# EAGLE design Grove - 2-Coil Latching Relay v1 (EAGLE 6.3)
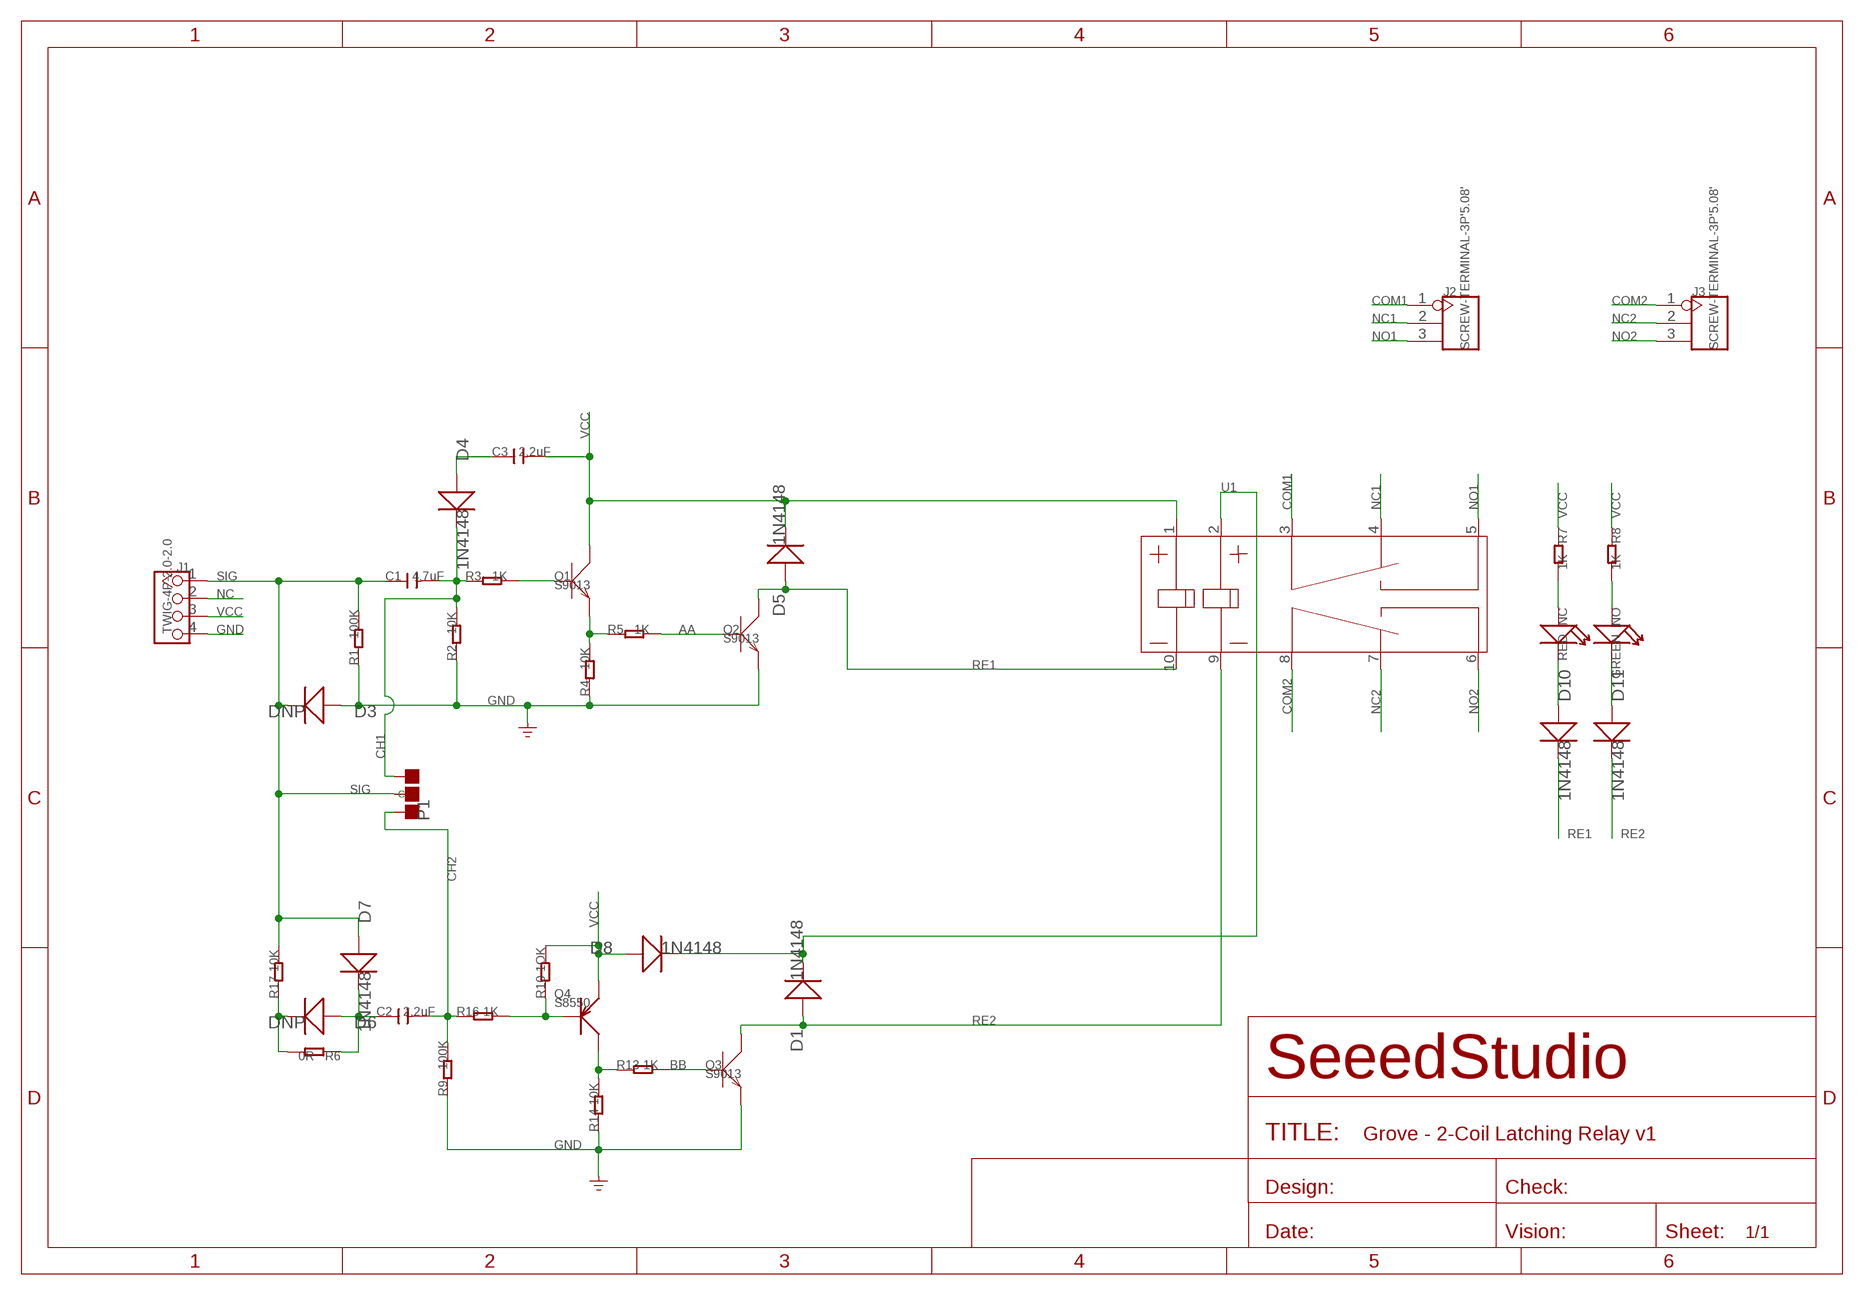
[diagram p0: schematic, sheet 1]

## Parts
C1  4.7uF  C-0805  [C0805]
C2  2.2uF  C-0805  [C0805]
C3  2.2uF  C-0805  [C0805]
D1  1N4148  D'1N4148-SMD'  [DO-35-SMD]
D3  DNP  D'1N4148-SMD'  [DO-35-SMD]
D4  1N4148  D'1N4148-SMD'  [DO-35-SMD]
D5  1N4148  D'1N4148-SMD'  [DO-35-SMD]
D6  DNP  D'1N4148-SMD'  [DO-35-SMD]
D7  1N4148  D'1N4148-SMD'  [DO-35-SMD]
D8  1N4148  D'1N4148-SMD'  [DO-35-SMD]
D10  1N4148  D'1N4148-SMD'  [DO-35-SMD]
D11  1N4148  D'1N4148-SMD'  [DO-35-SMD]
J1  TWIG-4P-2.0-2.0  [4P-2.0]
J2  SCREW-TERMINAL-3P'5.08'  [3P-5.08]
J3  SCREW-TERMINAL-3P'5.08'  [3P-5.08]
NC  RED  LED'0603'  [LED-0603]
NO  GREEN  LED'0603'  [LED-0603]
P1  PAD-JUMPER-3P-40*40  [3P-SMD-4.1X1.5]
Q1  S9013  TRANSISTOR-NPN-SOT23  [SOT23]
Q2  S9013  TRANSISTOR-NPN-SOT23  [SOT23]
Q3  S9013  TRANSISTOR-NPN-SOT23  [SOT23]
Q4  S8550  TRANSISTOR-PNP-SOT23  [SOT23]
R1  100K  R-0603  [R0603]
R2  10K  R-0603  [R0603]
R3  1K  R-0603  [R0603]
R4  10K  R-0603  [R0603]
R5  1K  R-0603  [R0603]
R6  0R  R-0603  [R0603]
R7  1K  R-0603  [R0603]
R8  1K  R-0603  [R0603]
R9  100K  R-0603  [R0603]
R10  1OK  R-0603  [R0603]
R13  1K  R-0603  [R0603]
R14  10K  R-0603  [R0603]
R16  1K  R-0603  [R0603]
R17  10K  R-0603  [R0603]
U1  RELAY-HFD2/005-S-L2'HFD2/005-S-L2'  [10P-20.2X10.2X10.6]

## Nets
AA: Q2.1(B) R5.2
BB: Q3.1(B) R13.2
CH1: C1.2 D4.C(-) P1.00(L) R2.2 R3.1
CH2: C2.2 P1.11(R) R9.2 R16.1
COM1: J2.1 U1.3
COM2: J3.1 U1.8
GND: D3.A(+) J1.4 Q2.2(E) Q3.2(E) R1.1 R2.1 R4.1 R9.1 R14.1
N$1: NO.+ R8.2
N$3: C3.1 D4.A(+)
N$4: Q1.1(B) R3.2
N$5: Q1.2(E) R4.2 R5.1
N$6: D10.A(+) NC.-
N$7: D11.A(+) NO.-
N$9: NC.+ R7.2
N$11: D6.C(-) R6.2 R17.1
N$12: C2.1 D6.A(+) D7.C(-) R6.1
N$15: Q4.1(B) R10.1 R16.2
N$17: D1.C(-) D8.C(-) U1.2
N$21: Q4.3(C) R13.1 R14.2
NC: J1.2
NC1: J2.2 U1.4
NC2: J3.2 U1.7
NO1: J2.3 U1.5
NO2: J3.3 U1.6
RE1: D5.A(+) D10.C(-) Q2.3(C) U1.10
RE2: D1.A(+) D11.C(-) Q3.3(C) U1.9
SIG: C1.1 D3.C(-) D7.A(+) J1.1 P1.MM(C) R1.2 R17.2
VCC: C3.2 D5.C(-) D8.A(+) J1.3 Q1.3(C) Q4.2(E) R7.1 R8.1 R10.2 U1.1

## Library data of the parts
C1-C3 = Discrete:C*: Ceramic Capacitors
D1 D3-D8 D10 D11 = Discrete:D*
J1 = Connector:TWIG-4P-2.0
J2 J3 = Connector:SCREW-TERMINAL-3P
NC NO = Discrete:LED*
P1 = Discrete:PAD-JUMPER-3P; PARTNO: DNP
Q1-Q3 = Discrete:TRANSISTOR-NPN*: NPN audion
Q4 = Discrete:TRANSISTOR-PNP*: PNP audion
R1-R10 R13 R14 R16 R17 = Discrete:R*
U1 = template:RELAY-HFD2/005-S-L2: 2 coils latching

## Board
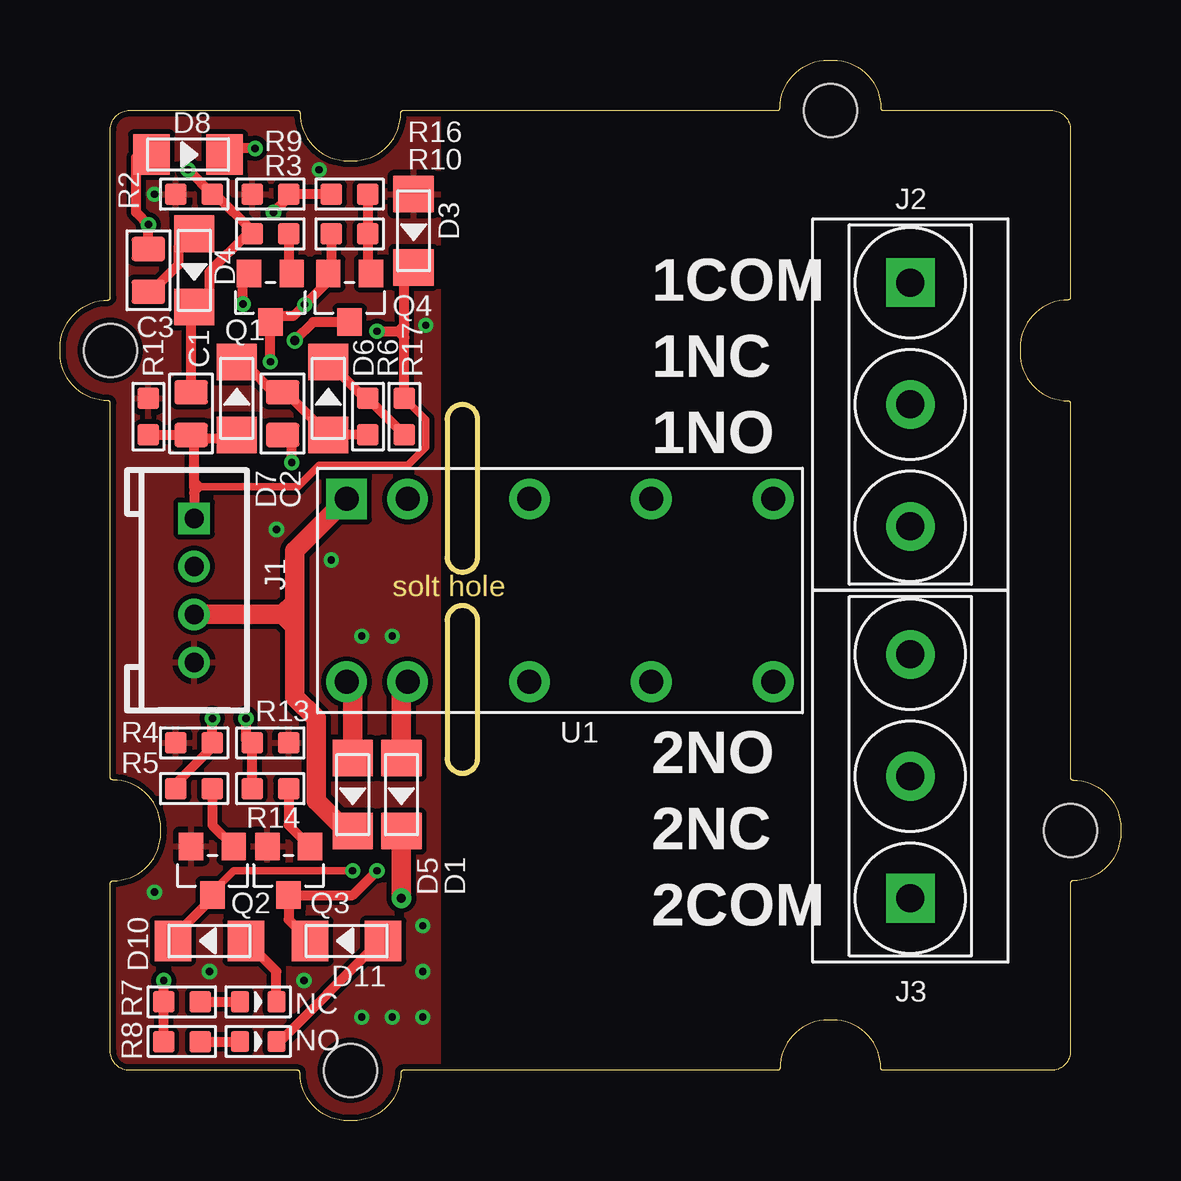
[diagram p1: board, top side]
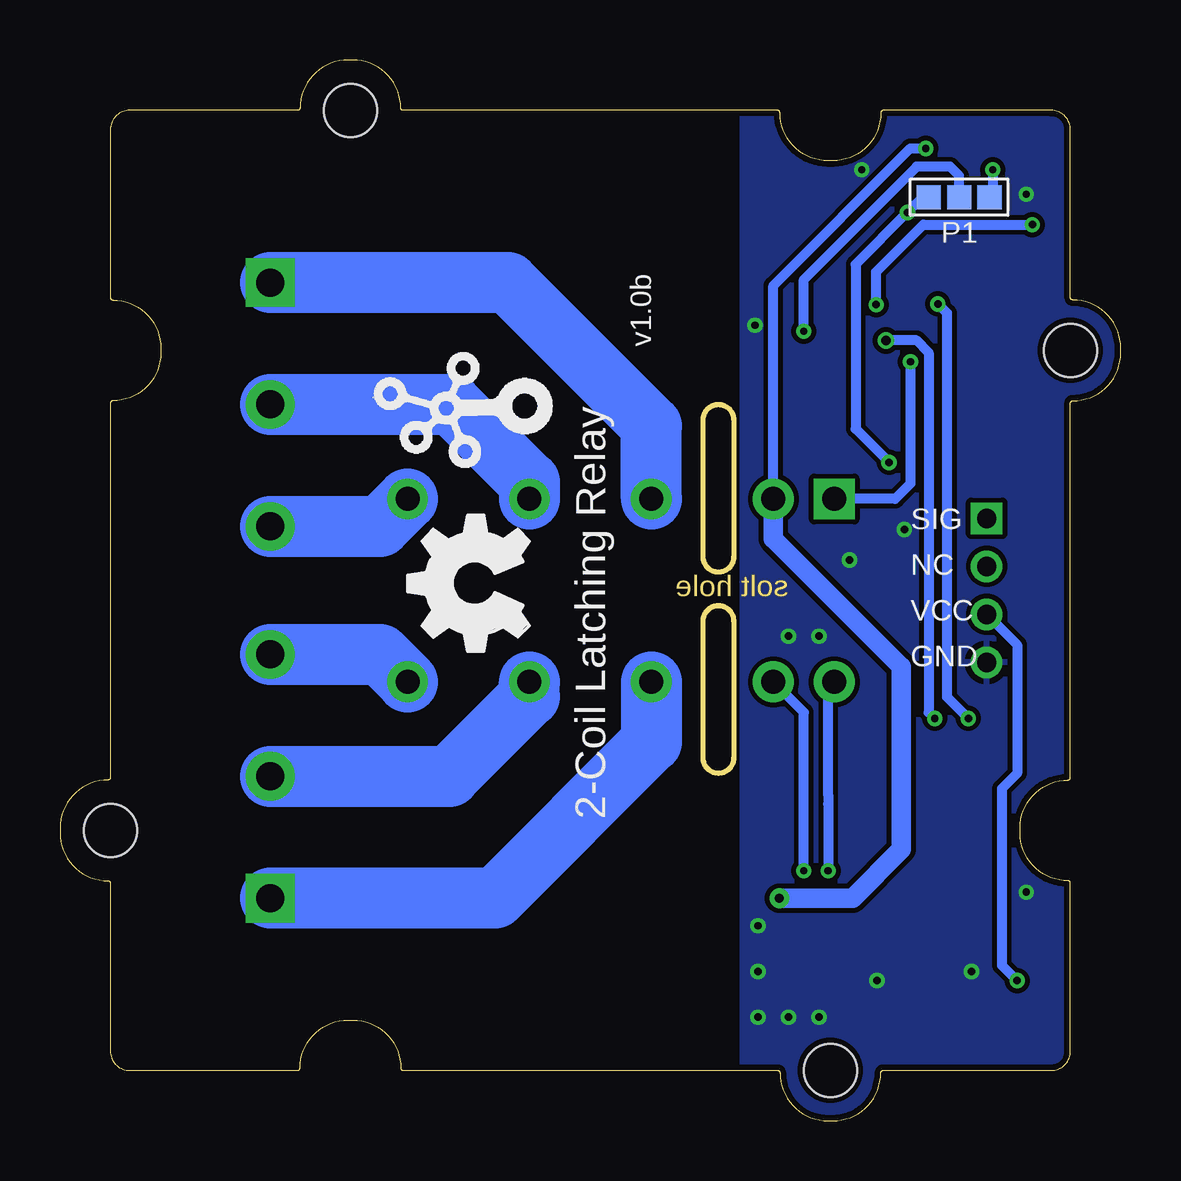
[diagram p2: board, bottom side, seen from below]

Size 44.2 x 44.2 mm. Coordinates in mm from the lower left corner, seen from the top.
Copper layers (1*16): Top 0.035mm / dielectric 1.5mm / Bottom 0.035mm
Design rules "SeeedStudio_rule_no_angle_090911 *": minimum track width 6mil, minimum drill 12mil, track to track 6mil, track to pad 6mil, pad to pad 6mil, via to via 6mil, smd to smd 0mil, copper to edge 10mil, drill to drill 10mil, minimum pad ring 10mil, minimum via ring 6mil, stop-mask expansion 2mil, vias tented up to drill 25mil, thermal gap 10mil
Milling: area 16.1,14.5 to 17.4,21.5; area 16.1,22.9 to 17.4,29.8

### Footprints (pad centres in the part's own frame; a part is rotated, then mirrored left to right if it is on the bottom)
C0805 = smd 1.016 x 1.397: 1 -0.889,0; 2 0.889,0
DO-35-SMD = smd 1.524 x 1.676: A -1.524,0; C 1.524,0
4P-2.0 = drill 0.8 pad 1.27 square: 1 -3,0 | drill 0.8 pad 1.27: 2 -1,0; 3 1,0; 4 3,0
3P-5.08 = drill 1.168 pad 2.032 square: 1 0,5.08 | drill 1.168 pad 2.032: 2 0,0; 3 0,-5.08
LED-0603 = smd 0.762 x 0.889: + -0.762,0; - 0.762,0
3P-SMD-4.1X1.5 = smd 1.016 x 1.016: 00 -1.27,0; 11 1.27,0; MM 0,0
SOT23 = smd 1.016 x 1.143: 1 -0.889,-1.016; 2 0.889,-1.016; 3 0,1.016
R0603 = smd 0.889 x 0.889: 1 -0.762,0; 2 0.762,0
10P-20.2X10.2X10.6 = drill 1 pad 1.7 square: 1 -8.89,3.81 | drill 1 pad 1.7: 2 -6.35,3.81; 3 -1.27,3.81; 4 3.81,3.81; 5 8.89,3.81; 6 8.89,-3.81; 7 3.81,-3.81; 8 -1.27,-3.81; 9 -6.35,-3.81; 10 -8.89,-3.81
2X2U-DIM-W/-DRILL = hole 2.2: 10,20; -20,10; -10,-20; 20,-10

### Placement (x,y rotation side)
C1  5.46,29.47 90 top
C2  9.27,29.47 270 top
C3  3.69,35.44 90 top
D1  14.23,13.59 270 top
D3  14.73,37.09 270 top
D4  5.59,35.44 270 top
D5  12.19,13.59 270 top
D6  11.18,30.1 90 top
D7  7.37,30.1 90 top
D8  5.34,40.26 0 top
D10  6.23,7.5 180 top
D11  11.94,7.5 180 top
J1  5.59,22.1 270 top
J2  35.44,29.85 0 top
J3  35.44,14.35 180 top
NC  8.26,4.96 0 top
NO  8.26,3.3 0 top
P1  6.73,38.48 180 bottom
Q1  8.77,34.29 180 top
Q2  6.35,10.42 180 top
Q3  9.53,10.42 180 top
Q4  12.07,34.29 180 top
R1  3.69,29.34 270 top
R2  5.59,38.61 0 top
R3  8.77,36.96 0 top
R4  5.59,15.75 0 top
R5  5.59,13.85 0 top
R6  12.83,29.34 90 top
R7  5.08,4.96 0 top
R8  5.08,3.3 0 top
R9  8.77,38.61 0 top
R10  12.07,36.96 180 top
R13  8.77,13.85 0 top
R14  8.77,15.75 180 top
R16  12.07,38.61 0 top
R17  14.35,29.34 90 top
U1  20.83,22.1 0 top
U$4  [2X2U-DIM-W/-DRILL]  22.1,22.1 0 top
U$5  [OSHW_FILLX200_NOTEXT]  24.64,19.56 90 bottom
U$6  [TWIGLOGO]  24.64,29.72 90 bottom

### Tracks (layer width: path | path; a pad name or v marks a point on that pad's centre or on a via)
AA
  Top 0.406: R5.2 6.35,12.32 Q2.1
BB
  Top 0.406: R13.2 9.53,12.32 Q3.1
CH1  (via drill 0.3 pad 0.64)
  Top 0.406: 5.21,30.36 C1.2 5.46,33.78 D4.C 6.1,33.91 6.23,34.04 6.23,35.37 7.81,36.96 R3.1 8,37.09 6.48,38.61 R2.2 v5.34,39.63
  Bottom 0.406: v5.34,39.63 5.34,38.61 P1.00
CH2  (via drill 0.3 pad 0.64)
  Top 0.406: R16.1 11.18,38.74 11.05,38.61 R9.2 9.53,38.48 v8.89,37.85 | C2.2 9.27,28.45 9.53,28.45 9.65,28.32 v9.65,27.43
  Bottom 0.406: v9.65,27.43 11.05,28.83 11.05,35.69 v8.89,37.85 8.13,38.61 P1.11
COM1
  Bottom 2.54: U1.3 19.56,28.96 25.53,34.93 J2.1
COM2
  Bottom 2.54: U1.8 19.56,15.78 26.07,9.27 J3.1
GND  (via drill 0.3 pad 0.64)
  other vias: 10.8,39.63 3.94,38.61 3.94,9.53 9.02,24.64 11.31,23.37 13.85,4.32 10.16,5.84 15.12,4.32 15.12,6.23 6.23,6.23 15.12,8.13 12.58,4.32 15.24,33.15 12.58,20.2 13.85,20.2
  pour Bottom (isolate 0.203): -0.12,-0.12 15.75,0 15.75,42.55 -0.12,42.42
  pour Top (isolate 0.203): -0.12,-0.12 15.75,0 15.75,42.55 -0.12,42.42
N$1
  Top 0.406: R8.2 NO.+
N$3
  Top 0.406: C3.1 3.81,34.55 4.96,35.69 4.96,36.45 5.08,36.58 5.21,36.58 D4.A
N$4
  Top 0.406: R3.2 9.53,35.44 Q1.1
N$5  (via drill 0.3 pad 0.64)
  Top 0.406: v6.35,16.77 R4.2 6.35,15.56 4.89,14.1 4.89,13.91 R5.1 | v7.62,34.04 7.62,35.18 7.75,35.31 Q1.2
  Bottom 0.406: v6.35,16.77 7.24,17.66 7.24,33.66 v7.62,34.04
N$6
  Top 0.406: NC.- 9.02,6.23 D10.A
N$7
  Top 0.406: NO.- 9.15,3.3 13.08,7.24 13.21,7.24 D11.A
N$9
  Top 0.406: R7.2 NC.+
N$11
  Top 0.406: R17.1 R6.2 12.7,30.1 D6.C
N$12
  Top 0.406: R6.1 D6.A 9.4,30.36 C2.1 8.89,30.36 7.88,31.37 7.62,31.37 D7.C
N$15
  Top 0.406: R16.2 R10.1 12.83,35.44 Q4.1
N$17  (via drill 0.3 pad 0.64, 0.38 pad 0.81)
  Top 0.406: v8.13,40.52 6.99,40.52 6.86,40.64 D8.C
  Top 0.813: D1.C v14.23,9.27
  Bottom 0.406: U1.2 14.48,34.8 8.77,40.52 v8.13,40.52
  Bottom 0.813: v14.23,9.27 11.18,9.27 9.15,11.31 9.15,18.93 14.48,24.26 U1.2
N$21  (via drill 0.3 pad 0.64, 0.38 pad 0.64)
  Top 0.406: R13.1 8,15.62 | 8,15.62 R14.2 | Q4.3 10.54,33.28 v9.78,32.51 | v7.75,16.77 7.75,15.88 8,15.62
  Bottom 0.406: v9.78,32.51 8.51,32.51 8,32.01 8,17.02 v7.75,16.77
NC1
  Bottom 2.54: J2.2 27.87,29.85 24.64,26.61 U1.4
NC2
  Bottom 2.54: J3.2 27.97,14.35 24.64,17.69 U1.7
NO1
  Bottom 2.54: J2.3 30.86,24.77 U1.5
NO2
  Bottom 2.54: J3.3 30.86,19.43 U1.6
RE1  (via drill 0.3 pad 0.64)
  Top 0.305: Q2.3 6.35,9.53 7.24,10.42 v12.19,10.42
  Top 0.406: D10.C 4.57,7.5 | 6.16,9.4 6.23,9.4 | 6.23,9.4 Q2.3 | 4.26,7.5 4.57,7.5 | 4.57,7.5 6.1,9.02 6.1,9.27 6.23,9.4
  Top 0.813: D5.A 12.19,18.04 U1.10
  Bottom 0.406: v12.19,10.42 12.19,13.21 12.19,13.59 12.19,18.04 U1.10
RE2  (via drill 0.3 pad 0.64)
  Top 0.406: D1.A 14.48,15.12 | D11.C 9.53,8.38 Q3.3 12.19,9.4 v13.21,10.42
  Top 0.813: D1.A 14.23,18.04 U1.9
  Bottom 0.406: v13.21,10.42 13.21,17.02 U1.9
SIG  (via drill 0.3 pad 0.64)
  Top 0.305: R17.2 15.24,29.21 15.24,28.07 14.48,27.31 10.8,27.31 9.91,26.42 5.84,26.42 | 5.59,28.32 5.46,28.45 C1.1 | 5.84,26.42 5.59,26.42 | 5.84,26.42 5.59,26.67 5.59,26.16 5.84,26.42
  Top 0.406: R1.2 C1.1 5.59,28.45 5.72,28.45 | 5.72,28.45 7.11,28.45 7.24,28.58 D7.A | 5.72,28.45 5.59,28.32 5.59,26.67 5.59,26.42 5.59,26.16 J1.1 | R17.2 14.35,32.64 | 14.35,32.64 14.35,32.9 | 14.35,32.9 14.35,33.15 | 14.35,33.15 14.35,35.31 14.61,35.56 D3.C | v13.21,32.9 14.1,32.9 | 14.1,32.9 14.35,32.9 | 14.1,32.9 14.35,33.15 | 14.1,32.9 14.35,32.64
  Bottom 0.406: P1.MM 6.73,39.37 7.11,39.75 8.51,39.75 13.21,35.05 v13.21,32.9
VCC  (via drill 0.3 pad 0.64)
  Top 0.406: R10.2 11.31,35.44 Q4.2 11.18,34.99 v10.19,34.01 9.72,33.53 8.77,33.53 Q1.3 v8.77,31.62 | R8.1 R7.1 v4.32,5.84 | C3.2 v3.69,37.34 3.18,37.85 3.18,40.13 3.3,40.26 D8.A
  Top 0.813: D5.C 11.94,12.07 10.67,13.34 10.67,16.77 9.78,17.66 9.78,20.58 | 9.78,20.58 9.78,20.96 | 9.78,20.96 9.78,21.59 | 9.78,21.59 9.78,23.75 U1.1 | J1.3 9.29,21.1 | 9.29,21.1 9.64,21.1 9.78,20.96 | 9.29,21.1 9.78,21.59 | 8.76,21.1 9.26,21.1 9.78,20.58
  Bottom 0.406: J1.3 4.32,19.83 4.32,14.48 4.96,13.85 4.96,6.48 v4.32,5.84 | v8.77,31.62 8.77,26.55 9.4,25.91 U1.1 | v10.19,34.01 10.19,35.37 8.23,37.34 v3.69,37.34

### Text on the board
tPlace: 1COM | 1NC | 1NO | 2NO | 2NC | 2COM
bPlace: v1.0b | SIG | NC | VCC | GND | 2-Coil Latching Relay
Milling: solt hole